# EAGLE design detectino (EAGLE 7.2.0)
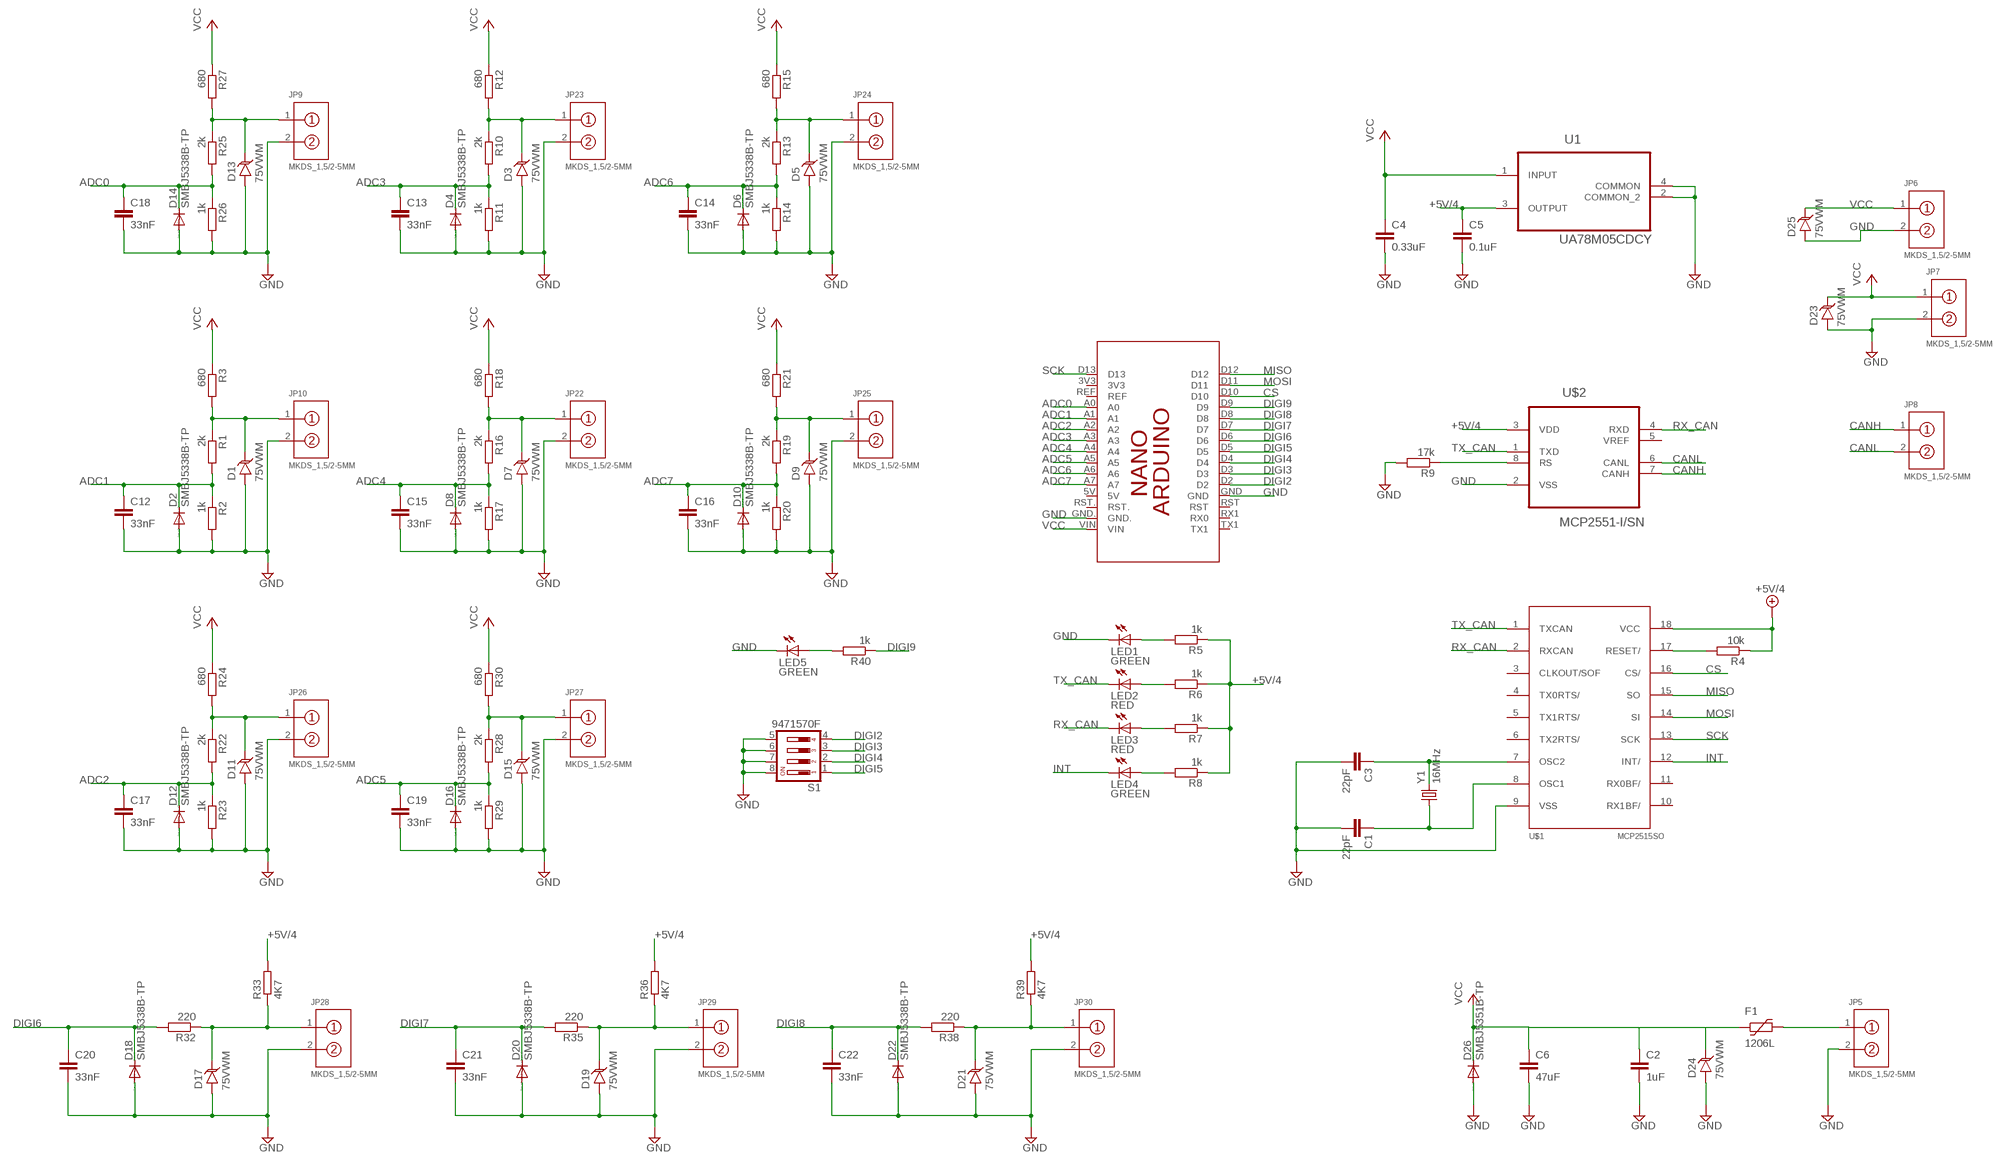
[diagram p0: schematic, sheet 1]

## Parts
C1  22pF  C-EUC1206K  [C1206K]
C2  1uF  C-EUC1206K  [C1206K]
C3  22pF  C-EUC1206K  [C1206K]
C4  0.33uF  C-EUC1206K  [C1206K]
C5  0.1uF  C-EUC1206K  [C1206K]
C6  47uF  C-EUC1206K  [C1206K]
C12  33nF  C-EUC1206K  [C1206K]
C13  33nF  C-EUC1206K  [C1206K]
C14  33nF  C-EUC1206K  [C1206K]
C15  33nF  C-EUC1206K  [C1206K]
C16  33nF  C-EUC1206K  [C1206K]
C17  33nF  C-EUC1206K  [C1206K]
C18  33nF  C-EUC1206K  [C1206K]
C19  33nF  C-EUC1206K  [C1206K]
C20  33nF  C-EUC1206K  [C1206K]
C21  33nF  C-EUC1206K  [C1206K]
C22  33nF  C-EUC1206K  [C1206K]
D1  75VWM  TVS75VWM  [SMC]
D2  SMBJ5338B-TP  DIODE-DO214AA  [DO214AA]
D3  75VWM  TVS75VWM  [SMC]
D4  SMBJ5338B-TP  DIODE-DO214AA  [DO214AA]
D5  75VWM  TVS75VWM  [SMC]
D6  SMBJ5338B-TP  DIODE-DO214AA  [DO214AA]
D7  75VWM  TVS75VWM  [SMC]
D8  SMBJ5338B-TP  DIODE-DO214AA  [DO214AA]
D9  75VWM  TVS75VWM  [SMC]
D10  SMBJ5338B-TP  DIODE-DO214AA  [DO214AA]
D11  75VWM  TVS75VWM  [SMC]
D12  SMBJ5338B-TP  DIODE-DO214AA  [DO214AA]
D13  75VWM  TVS75VWM  [SMC]
D14  SMBJ5338B-TP  DIODE-DO214AA  [DO214AA]
D15  75VWM  TVS75VWM  [SMC]
D16  SMBJ5338B-TP  DIODE-DO214AA  [DO214AA]
D17  75VWM  TVS75VWM  [SMC]
D18  SMBJ5338B-TP  DIODE-DO214AA  [DO214AA]
D19  75VWM  TVS75VWM  [SMC]
D20  SMBJ5338B-TP  DIODE-DO214AA  [DO214AA]
D21  75VWM  TVS75VWM  [SMC]
D22  SMBJ5338B-TP  DIODE-DO214AA  [DO214AA]
D23  75VWM  TVS75VWM  [SMC]
D24  75VWM  TVS75VWM  [SMC]
D25  75VWM  TVS75VWM  [SMC]
D26  SMBJ5351B-TP  DIODE-DO214AA  [DO214AA]
F1  1206L  [1206L]
JP5  MKDS_1,5/2-5MM  [MKDS_1,5/2-5MM]
JP6  MKDS_1,5/2-5MM  [MKDS_1,5/2-5MM]
JP7  MKDS_1,5/2-5MM  [MKDS_1,5/2-5MM]
JP8  MKDS_1,5/2-5MM  [MKDS_1,5/2-5MM]
JP9  MKDS_1,5/2-5MM  [MKDS_1,5/2-5MM]
JP10  MKDS_1,5/2-5MM  [MKDS_1,5/2-5MM]
JP22  MKDS_1,5/2-5MM  [MKDS_1,5/2-5MM]
JP23  MKDS_1,5/2-5MM  [MKDS_1,5/2-5MM]
JP24  MKDS_1,5/2-5MM  [MKDS_1,5/2-5MM]
JP25  MKDS_1,5/2-5MM  [MKDS_1,5/2-5MM]
JP26  MKDS_1,5/2-5MM  [MKDS_1,5/2-5MM]
JP27  MKDS_1,5/2-5MM  [MKDS_1,5/2-5MM]
JP28  MKDS_1,5/2-5MM  [MKDS_1,5/2-5MM]
JP29  MKDS_1,5/2-5MM  [MKDS_1,5/2-5MM]
JP30  MKDS_1,5/2-5MM  [MKDS_1,5/2-5MM]
LED1  GREEN  LEDSML1206  [SML1206]
LED2  RED  LEDSML1206  [SML1206]
LED3  RED  LEDSML1206  [SML1206]
LED4  GREEN  LEDSML1206  [SML1206]
LED5  GREEN  LEDSML1206  [SML1206]
PCB2  ARDUINO_NANO  [ARDUINO_NANO]
R1  2k  R-EU_R1206  [R1206]
R2  1k  R-EU_R1206  [R1206]
R3  680  R-EU_R1206  [R1206]
R4  10k  R-EU_R1206  [R1206]
R5  1k  R-EU_R1206  [R1206]
R6  1k  R-EU_R1206  [R1206]
R7  1k  R-EU_R1206  [R1206]
R8  1k  R-EU_R1206  [R1206]
R9  17k  R-EU_R1206  [R1206]
R10  2k  R-EU_R1206  [R1206]
R11  1k  R-EU_R1206  [R1206]
R12  680  R-EU_R1206  [R1206]
R13  2k  R-EU_R1206  [R1206]
R14  1k  R-EU_R1206  [R1206]
R15  680  R-EU_R1206  [R1206]
R16  2k  R-EU_R1206  [R1206]
R17  1k  R-EU_R1206  [R1206]
R18  680  R-EU_R1206  [R1206]
R19  2k  R-EU_R1206  [R1206]
R20  1k  R-EU_R1206  [R1206]
R21  680  R-EU_R1206  [R1206]
R22  2k  R-EU_R1206  [R1206]
R23  1k  R-EU_R1206  [R1206]
R24  680  R-EU_R1206  [R1206]
R25  2k  R-EU_R1206  [R1206]
R26  1k  R-EU_R1206  [R1206]
R27  680  R-EU_R1206  [R1206]
R28  2k  R-EU_R1206  [R1206]
R29  1k  R-EU_R1206  [R1206]
R30  680  R-EU_R1206  [R1206]
R32  220  R-EU_R1206  [R1206]
R33  4K7  R-EU_R1206  [R1206]
R35  220  R-EU_R1206  [R1206]
R36  4K7  R-EU_R1206  [R1206]
R38  220  R-EU_R1206  [R1206]
R39  4K7  R-EU_R1206  [R1206]
R40  1k  R-EU_R1206  [R1206]
S1  9471570F  DS04  [DS-04]
U1  UA78M05CDCY  [SOT230P700X180-4N]
U$1  MCP2515SO  [SO18L]
U$2  MCP2551-I/SN  [SOIC127P600X175-8N]
Y1  16MHz  CRYSTALHC49US  [HC49US]

## Nets
+5V/4: C5.1 R4.1 R5.1 R6.1 R7.1 R8.1 R33.2 R36.2 R39.2 U1.3(OUTPUT) U$1.18(VCC) U$2.3(VDD)
ADC0: C18.1 D14.C PCB2.A0 R25.2 R26.1
ADC1: C12.1 D2.C PCB2.A1 R1.2 R2.1
ADC2: C17.1 D12.C PCB2.A2 R22.2 R23.1
ADC3: C13.1 D4.C PCB2.A3 R10.2 R11.1
ADC4: C15.1 D8.C PCB2.A4 R16.2 R17.1
ADC5: C19.1 D16.C PCB2.A5 R28.2 R29.1
ADC6: C14.1 D6.C PCB2.A6 R13.2 R14.1
ADC7: C16.1 D10.C PCB2.A7 R19.2 R20.1
CANH [signal20]: JP8.1 U$2.7(CANH)
CANL [signal20]: JP8.2 U$2.6(CANL)
CS [signal]: PCB2.D10 U$1.16(CS/)
DIGI2 [signal]: PCB2.D2 S1.4
DIGI3 [signal]: PCB2.D3 S1.3
DIGI4 [signal]: PCB2.D4 S1.2
DIGI5 [signal]: PCB2.D5 S1.1
DIGI6 [signal]: C20.1 D18.C PCB2.D6 R32.2
DIGI7 [signal]: C21.1 D20.C PCB2.D7 R35.2
DIGI8 [signal]: C22.1 D22.C PCB2.D8 R38.2
DIGI9: PCB2.D9 R40.1
GND [ground]: C1.2 C2.2 C3.2 C4.2 C5.2 C6.2 C12.2 C13.2 C14.2 C15.2 C16.2 C17.2 C18.2 C19.2 C20.2 C21.2 C22.2 D1.A D2.A D3.A D4.A D5.A D6.A D7.A D8.A D9.A D10.A D11.A D12.A D13.A D14.A D15.A D16.A D17.A D18.A D19.A D20.A D21.A D22.A D23.A D24.A D25.A D26.A JP5.2 JP6.2 JP7.2 JP9.2 JP10.2 JP22.2 JP23.2 JP24.2 JP25.2 JP26.2 JP27.2 JP28.2 JP29.2 JP30.2 LED1.C LED5.C PCB2.GND PCB2.GND. R2.2 R9.2 R11.2 R14.2 R17.2 R20.2 R23.2 R26.2 R29.2 S1.5 S1.6 S1.7 S1.8 U1.2(COMMON_2) U1.4(COMMON) U$1.9(VSS) U$2.2(VSS)
INT: LED4.C U$1.12(INT/)
MISO [signal]: PCB2.D12 U$1.15(SO)
MOSI [signal]: PCB2.D11 U$1.14(SI)
N$1 [signal20]: D1.C JP10.1 R1.1 R3.2
N$2 [signal]: R4.2 U$1.17(RESET/)
N$3: C1.1 U$1.8(OSC1) Y1.1
N$4: C3.1 U$1.7(OSC2) Y1.2
N$6: LED1.A R5.2
N$7: LED2.A R6.2
N$8: LED3.A R7.2
N$9: LED4.A R8.2
N$10: R9.1 U$2.8(RS)
N$11 [vcc2]: F1.P$2 JP5.1
N$13 [signal20]: D3.C JP23.1 R10.1 R12.2
N$14 [signal20]: D5.C JP24.1 R13.1 R15.2
N$15 [signal20]: D7.C JP22.1 R16.1 R18.2
N$16 [signal20]: D9.C JP25.1 R19.1 R21.2
N$17 [signal20]: D11.C JP26.1 R22.1 R24.2
N$18 [signal20]: D13.C JP9.1 R25.1 R27.2
N$19 [signal20]: D15.C JP27.1 R28.1 R30.2
N$21 [signal20]: D17.C JP28.1 R32.1 R33.1
N$23 [signal20]: D19.C JP29.1 R35.1 R36.1
N$25 [signal20]: D21.C JP30.1 R38.1 R39.1
N$26: LED5.A R40.2
RX_CAN [signal]: LED3.C U$1.2(RXCAN) U$2.4(RXD)
SCK [signal]: PCB2.D13 U$1.13(SCK)
TX_CAN [signal]: LED2.C U$1.1(TXCAN) U$2.1(TXD)
VCC [vcc]: C2.1 C4.1 C6.1 D23.C D24.C D25.C D26.C F1.P$1 JP6.1 JP7.1 PCB2.VIN R3.1 R12.1 R15.1 R18.1 R21.1 R24.1 R27.1 R30.1 U1.1(INPUT)
Unconnected: PCB2.3V3 PCB2.5V PCB2.REF PCB2.RST PCB2.RST. PCB2.RX1(RX0) PCB2.TX1 U$1.3(CLKOUT/SOF) U$1.4(TX0RTS/) U$1.5(TX1RTS/) U$1.6(TX2RTS/) U$1.10(RX1BF/) U$1.11(RX0BF/) U$2.5(VREF)

## Library data of the parts
C1-C6 C12-C22 = rcl:C-EU: CAPACITOR, European symbol
D1 D3 D5 D7 D9 D11 D13 D15 D17 D19 D21 D23-D25 = SparkFun-DiscreteSemi:TVS: Transient voltage suppressor- prevents ESD on inputs.; PROD_ID: DIO-12443
D2 D4 D6 D8 D10 D12 D14 D16 D18 D20 D22 D26 = diode:DIODE-: DIODE
F1 = ptc-littlefuse:1206L
JP5-JP10 JP22-JP30 = con-phonenix-mkds:MKDS_1,5/2-5MM
LED1-LED5 = led:LED: LED OSRAM: - CHIPLED LG R971, LG N971, LY N971, LG Q971, LY Q971, LO R971, LY R971 LH N974, LH R974 LS Q976, LO Q976, LY Q976 LO Q996 - Hyper CHIPLED LW Q18S LB Q993, LB Q99A, LB R99A - SideLED LS A670, LO A670, LY A670, LG A670, LP A670 LB A673, LV A673, LT A673, LW A673 LH A674 LY A675 LS A676, LA A676, LO A676, LY A676, LW A676 LS A679, LY A679, LG A679 - Hyper Micro SIDELED® LS Y876, LA Y876, LO Y876, LY Y876 LT Y87S - SmartLED LW L88C, LW L88S LB L89C, LB L89S, LG L890 LS L89K, LO L89K, LY L89K LS L896, LA L896, LO L896, LY L896 - TOPLED LS T670, LO T670, LY T670, LG T670, LP T670 LSG T670, LSP T670, LSY T670, LOP T670, LYG T670 LG T671, LOG T671, LSG T671 LB T673, LV T673, LT T673, LW T673 LH T674 LS T676, LA T676, LO T676, LY T676, LB T676, LH T676, LSB T676, LW T676 LB T67C, LV T67C, LT T67C, LS T67K, LO T67K, LY T67K, LW E67C LS E67B, LA E67B, LO E67B, LY E67B, LB E67C, LV E67C, LT E67C LW T67C LS T679, LY T679, LG T679 LS T770, LO T770, LY T770, LG T770, LP T770 LB T773, LV T773, LT T773, LW T773 LH T774 LS E675, LA E675, LY E675, LS T675 LS T776, LA T776, LO T776, LY T776, LB T776 LHGB T686 LT T68C, LB T68C - Hyper Mini TOPLED® LB M676 - Mini TOPLED Santana® LG M470 LS M47K, LO M47K, LY M47K Source: http://www.osram.convergy.de LUXEON: - LUMILED® LXK2-PW12-R00, LXK2-PW12-S00, LXK2-PW14-U00, LXK2-PW14-V00 LXK2-PM12-R00, LXK2-PM12-S00, LXK2-PM14-U00 LXK2-PE12-Q00, LXK2-PE12-R00, LXK2-PE12-S00, LXK2-PE14-T00, LXK2-PE14-U00 LXK2-PB12-K00, LXK2-PB12-L00, LXK2-PB12-M00, LXK2-PB14-N00, LXK2-PB14-P00, LXK2-PB14-Q00 LXK2-PR12-L00, LXK2-PR12-M00, LXK2-PR14-Q00, LXK2-PR14-R00 LXK2-PD12-Q00, LXK2-PD12-R00, LXK2-PD12-S00 LXK2-PH12-R00, LXK2-PH12-S00 LXK2-PL12-P00, LXK2-PL12-Q00, LXK2-PL12-R00 Source: www.luxeon.com KINGBRIGHT: KA-3528ASYC Source: www.kingbright.com
PCB2 = E14_Arduino_published:ARDUINO_NANO: Device for representing an Arduino Nano board with a footprint in an EAGLE design. Created by Dave Young for Element14. More EAGLE documentation at: http://www.element14.com/community/community/knode/cadsoft_eagle
R1-R30 R32 R33 R35 R36 R38-R40 = rcl:R-EU_: RESISTOR, European symbol
S1 = switch-dil:DS04: DIL/CODE SWITCH; OC_FARNELL: 9471570; OC_NEWARK: unknown
U1 = Texas Instruments_By_element14_Batch_1:UA78M05CDCY: IC, LINEAR VOLT REGULATOR, 5V; MPN: UA78M05CDCY; OC_FARNELL: 1575761; OC_NEWARK: 77C1885; PACKAGE: SOT-223-3; SUPPLIER: TEXAS INSTRUMENTS
U$1 = MCP2515_MT:MCP2515*: MCP2515 Standalone CAN-Controller by Microchip Eagle-Lib. by MartinThomas
U$2 = Microchip_By_element14_Batch_1:MCP2551-I/SN: High-Speed CAN Transceiver; MPN: MCP2551-I/SN; OC_FARNELL: 9758569; OC_NEWARK: 69K7604; PACKAGE: SOIC-8; SUPPLIER: Microchip
Y1 = SparkFun-FreqCtrl:CRYSTAL: Various standard crystals. Proven footprints.

## Net classes
0 default: width 0.254 mm, clearance 0.203 mm
1 ground: width 0.508 mm, clearance 0.203 mm
2 vcc: width 0.508 mm, clearance 0.203 mm
3 signal: width 0.254 mm, clearance 0.203 mm
4 vcc2: width 0.762 mm, clearance 0.203 mm
5 signal20: width 0.508 mm, clearance 0.203 mm

## Board
JP13: 710-691211720002 Mouser
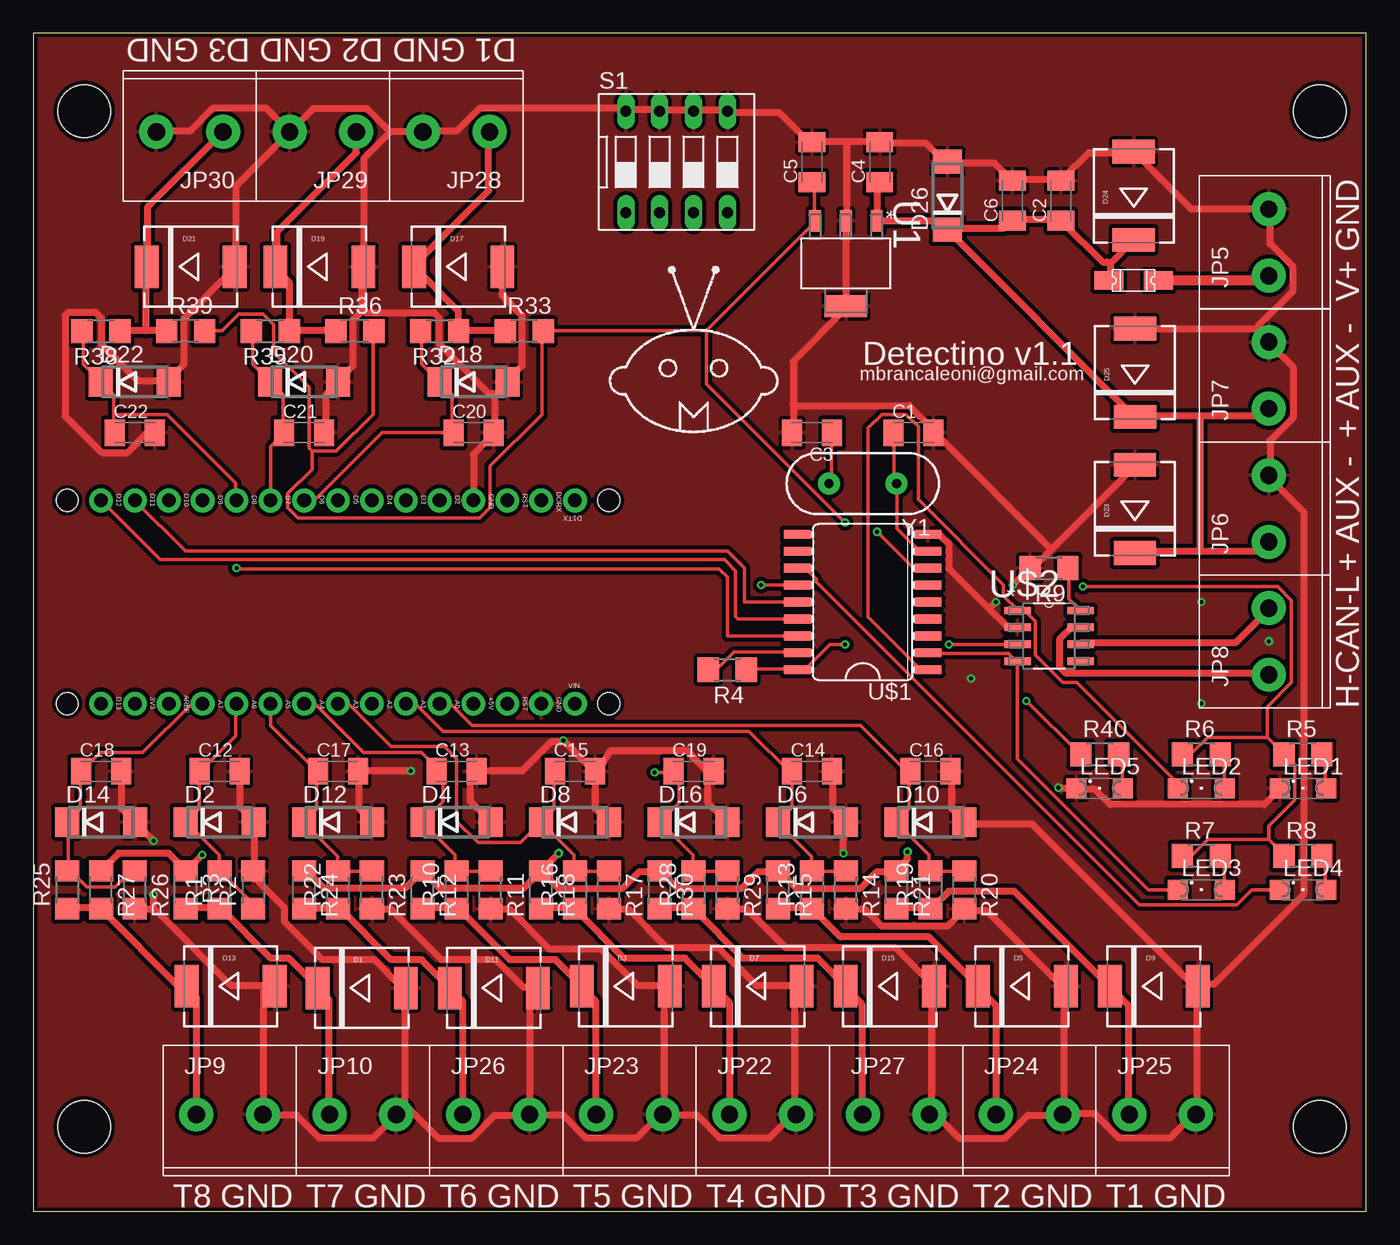
[diagram p1: board, top side]
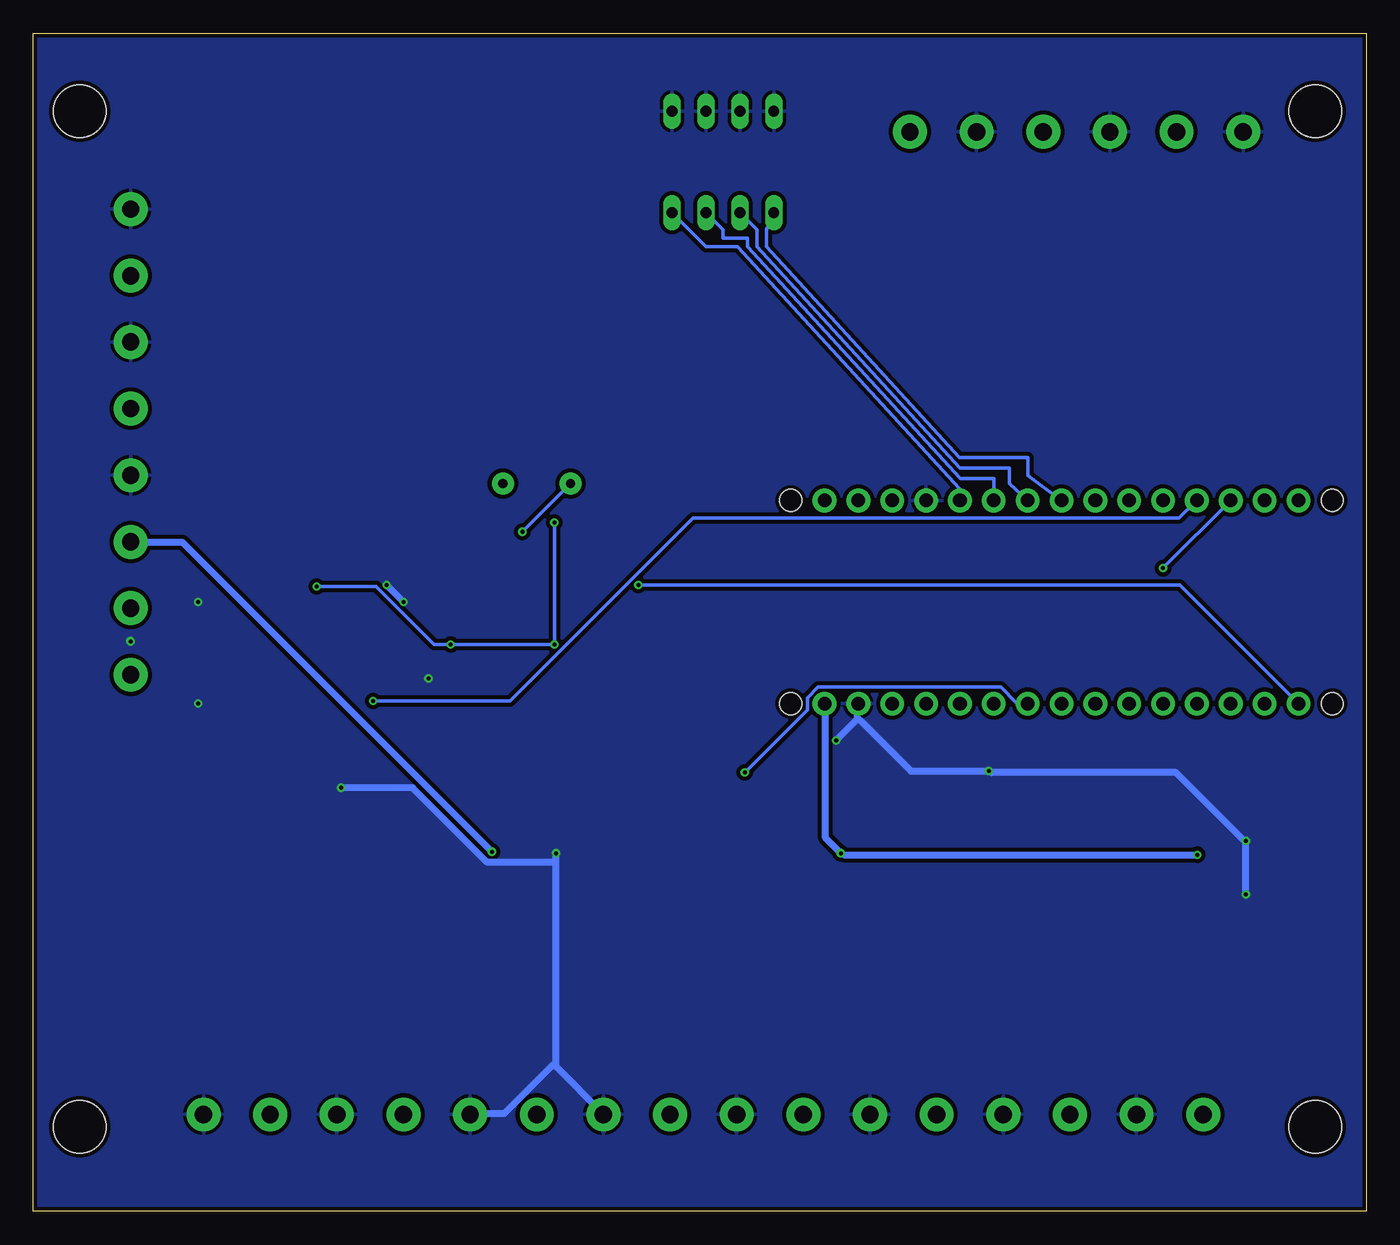
[diagram p2: board, bottom side, seen from below]

Size 100 x 88.39 mm. Coordinates in mm from the lower left corner, seen from the top.
Outline: 0,0 100,0 100,88.39 0,88.39 0,0
Copper layers (1*16): Top 0.035mm / dielectric 1.5mm / Bottom 0.035mm
Design rules "SeeedStudio_2layer_DRU_no_angle_20140221": minimum track width 6mil, minimum drill 12mil, track to track 6mil, track to pad 6mil, pad to pad 6mil, via to via 6mil, smd to smd 0mil, copper to edge 10mil, drill to drill 10mil, minimum pad ring 10mil, minimum via ring 6mil, stop-mask expansion 2mil, vias tented up to drill 100mil, thermal gap 10mil
Holes 3.96 mm at 96.52,6.35 96.52,82.55 3.81,82.55 3.81,6.35

### Footprints (pad centres in the part's own frame; a part is rotated, then mirrored left to right if it is on the bottom)
C1206K = smd 1.5 x 2: 1 -1.5,0; 2 1.5,0
SMC = smd 1.778 x 3.175: A 3.302,0; C -3.302,0
DO214AA = smd 1.8 x 2.2: A 2.55,0; C -2.55,0
1206L = smd 2.16 x 1.4: P$1 -1.85,0; P$2 1.85,0
MKDS_1,5/2-5MM = drill 1.3 pad 2.54: 1 -2.5,0; 2 2.5,0
SML1206 = smd 1.5 x 1.5: A 1.75,0; C -1.75,0
ARDUINO_NANO = drill 1.016 pad 1.778: 3V3 6.35,1.27; 5V 31.75,1.27; A0 11.43,1.27; A1 13.97,1.27; A2 16.51,1.27; A3 19.05,1.27; A4 21.59,1.27; A5 24.13,1.27; A6 26.67,1.27; A7 29.21,1.27; D2 29.21,16.51; D3 26.67,16.51; D4 24.13,16.51; D5 21.59,16.51; D6 19.05,16.51; D7 16.51,16.51; D8 13.97,16.51; D9 11.43,16.51; D10 8.89,16.51; D11 6.35,16.51; D12 3.81,16.51; D13 3.81,1.27; GND 31.75,16.51; GND. 36.83,1.27; REF 8.89,1.27; RST 34.29,16.51; RST. 34.29,1.27; RX1 36.83,16.51; TX1 39.37,16.51; VIN 39.37,1.27 | hole 1.651: 1.27,1.27; 1.27,16.51; 41.91,16.51; 41.91,1.27
R1206 = smd 1.6 x 1.803: 1 -1.422,0; 2 1.422,0
DS-04 = drill 0.813 long: 1 -3.81,-3.81; 2 -1.27,-3.81; 3 1.27,-3.81; 4 3.81,-3.81; 5 3.81,3.81; 6 1.27,3.81; 7 -1.27,3.81; 8 -3.81,3.81
SOT230P700X180-4N = smd 1.626 x 0.889: 1 -3.2,2.311; 2 -3.2,0; 3 -3.2,-2.311 | smd 1.626 x 3.175: 4 3.2,0
SO18L = smd 0.66 x 2.032: 1 -5.08,-4.902; 2 -3.81,-4.902; 3 -2.54,-4.902; 4 -1.27,-4.902; 5 0,-4.902; 6 1.27,-4.902; 7 2.54,-4.902; 8 3.81,-4.902; 9 5.08,-4.902; 10 5.08,4.902; 11 3.81,4.902; 12 2.54,4.902; 13 1.27,4.902; 14 0,4.902; 15 -1.27,4.902; 16 -2.54,4.902; 17 -3.81,4.902; 18 -5.08,4.902
SOIC127P600X175-8N = smd 1.981 x 0.559: 1 -2.362,1.905; 2 -2.362,0.635; 3 -2.362,-0.635; 4 -2.362,-1.905; 5 2.362,-1.905; 6 2.362,-0.635; 7 2.362,0.635; 8 2.362,1.905
HC49US = drill 0.7 pad 1.651: 1 -2.54,0; 2 2.54,0

### Placement (x,y rotation side)
C1  66.04,58.42 0 top
C2  77.09,75.82 90 top
C3  58.42,58.42 180 top
C4  63.5,78.74 90 top
C5  58.42,78.74 90 top
C6  73.46,75.82 90 top
C12  13.97,33.02 0 top
C13  31.75,33.02 0 top
C14  58.42,33.02 0 top
C15  40.64,33.02 0 top
C16  67.31,33.02 0 top
C17  22.86,33.02 0 top
C18  5.08,33.02 0 top
C19  49.53,33.02 0 top
C20  33.02,58.42 0 top
C21  20.32,58.42 0 top
C22  7.62,58.42 0 top
D1  24.64,16.76 0 top
D2  13.97,29.21 0 top
D3  44.45,16.89 0 top
D4  31.75,29.21 0 top
D5  74.17,16.89 0 top
D6  58.42,29.21 0 top
D7  54.36,16.89 0 top
D8  40.64,29.21 0 top
D9  84.07,16.89 0 top
D10  67.31,29.21 0 top
D11  34.54,16.76 0 top
D12  22.86,29.21 0 top
D13  14.81,16.89 0 top
D14  5.08,29.21 0 top
D15  64.26,16.89 0 top
D16  49.53,29.21 0 top
D17  31.88,70.87 0 top
D18  33.02,62.23 0 top
D19  21.46,70.87 0 top
D20  20.32,62.23 0 top
D21  11.81,70.87 0 top
D22  7.62,62.23 0 top
D23  82.65,52.71 90 top
D24  82.55,76.2 90 top
D25  82.65,62.93 90 top
D26  68.58,76.2 90 top
F1  82.55,69.85 0 top
JP5  92.69,72.7 90 top
JP6  92.69,52.73 90 top
JP7  92.69,62.73 90 top
JP8  92.69,42.76 90 top
JP9  14.73,7.27 0 top
JP10  24.73,7.27 0 top
JP22  54.73,7.27 0 top
JP23  44.73,7.27 0 top
JP24  74.73,7.27 0 top
JP25  84.73,7.27 0 top
JP26  34.73,7.27 0 top
JP27  64.73,7.27 0 top
JP28  31.73,81 180 top
JP29  21.73,81 180 top
JP30  11.73,81 180 top
LED1  95.25,31.75 0 top
LED2  87.63,31.75 0 top
LED3  87.63,24.13 0 top
LED4  95.25,24.13 0 top
LED5  80.01,31.75 0 top
PCB2  1.27,36.83 0 top
R1  13.97,24.13 90 top
R2  16.51,24.13 90 top
R3  11.43,24.13 270 top
R4  52.07,40.64 180 top
R5  95.25,34.29 0 top
R6  87.63,34.29 0 top
R7  87.63,26.67 0 top
R8  95.25,26.67 0 top
R9  76.2,48.26 180 top
R10  31.75,24.13 90 top
R11  34.29,24.13 270 top
R12  29.21,24.13 270 top
R13  58.42,24.13 90 top
R14  60.96,24.13 270 top
R15  55.88,24.13 270 top
R16  40.64,24.13 90 top
R17  43.18,24.13 270 top
R18  38.1,24.13 270 top
R19  67.31,24.13 90 top
R20  69.85,24.13 270 top
R21  64.77,24.13 270 top
R22  22.86,24.13 90 top
R23  25.4,24.13 270 top
R24  20.32,24.13 270 top
R25  2.54,24.13 90 top
R26  7.62,24.13 270 top
R27  5.08,24.13 270 top
R28  49.53,24.13 90 top
R29  52.07,24.13 270 top
R30  46.99,24.13 270 top
R32  30.48,66.04 180 top
R33  36.83,66.04 0 top
R35  17.78,66.04 180 top
R36  24.13,66.04 0 top
R38  5.08,66.04 180 top
R39  11.43,66.04 0 top
R40  80.01,34.29 0 top
S1  48.26,78.74 0 top
U1  60.96,71.12 270 top
U$1  62.23,45.72 90 top
U$2  76.2,43.18 0 top
U$5  [LOGO]  49.53,62.23 0 top
Y1  62.23,54.61 180 top

### Tracks (layer width: path | path; a pad name or v marks a point on that pad's centre or on a via)
+5V/4  (via drill 0.3)
  Top 0.254: 92.69,27.9 88.11,27.9 86.97,26.76 86.28,26.76 R7.1 | 92.69,27.9 93.83,26.76 R8.1 | 92.57,35.56 88.11,35.56 86.86,34.3 86.28,34.3 R6.1 | 92.57,35.56 93.83,34.3 R5.1 93.94,34.19 94.63,33.5 94.63,30.87 92.69,28.93 92.69,27.9 | R4.1 53.59,40.7 57.25,40.7 U$1.18 57.37,40.7 57.94,40.7 59.77,42.53 v60.91,42.53 | v68.68,42.53 73.83,42.53 U$2.3 | 92.57,35.56 92.57,37.85 94.4,39.68 94.4,45.85 93.37,46.88 v78.74,46.88 | 20.9,57.05 20.68,57.28 20.68,61.85 18.05,64.48 18.05,66.53 17.25,67.33 15.42,67.33 14.16,66.08 12.9,66.08 R39.2 | 20.9,57.05 22.73,57.05 25.48,59.79 25.48,65.96 R36.2 | C5.1 58.51,77.16 58.62,77.05 58.62,74.42 U1.3 58.62,74.19 50.51,66.08 | 50.51,66.08 38.28,66.08 R33.2 38.16,65.96 38.16,59.79 34.28,55.91 34.28,52.82 33.48,52.02 19.88,52.02 19.07,52.82 19.07,53.85 20.9,55.68 20.9,57.05 | v60.91,51.68 50.51,62.08 50.51,66.08
  Bottom 0.254: v78.74,46.88 74.28,46.88 69.94,42.53 v68.68,42.53 v60.91,42.53 v60.91,51.68
ADC0
  Top 0.254: R26.1 7.53,25.5 7.3,25.5 6.16,24.36 3.99,24.36 2.73,25.62 R25.2 2.62,25.62 2.62,29.16 D14.C 2.62,29.27 3.53,30.19 3.53,32.93 C18.1 3.65,33.05 5.02,34.42 8.22,34.42 11.88,38.08 12.68,38.08 PCB2.A0
ADC1
  Top 0.254: R2.1 16.45,22.76 16.45,23.1 14.05,25.5 R1.2 13.93,25.62 13.93,26.76 11.53,29.16 D2.C 11.53,29.27 12.45,30.19 12.45,32.93 C12.1 12.56,33.05 15.19,35.67 15.19,38.08 PCB2.A1
ADC2
  Top 0.254: R23.1 25.36,25.5 22.96,25.5 R22.2 22.85,25.62 22.85,26.64 20.33,29.16 D12.C 20.33,29.27 21.25,30.19 21.25,32.93 C17.1 21.25,33.05 17.82,36.47 17.82,38.08 PCB2.A2
ADC3
  Top 0.254: R11.1 34.28,25.5 31.76,25.5 R10.2 31.65,25.62 31.65,26.76 29.25,29.16 D4.C 29.25,29.27 30.73,30.76 30.73,32.93 C13.1 30.62,32.93 29.13,34.42 24.79,34.42 21.13,38.08 20.33,38.08 PCB2.A3
ADC4
  Top 0.254: R17.1 43.08,25.5 40.68,25.5 R16.2 40.56,25.62 40.56,26.76 38.16,29.16 D8.C | C15.1 39.08,32.93 39.08,30.19 38.16,29.27 D8.C | PCB2.A4 22.96,38.08 23.65,38.08 26.85,34.87 30.85,34.87 31.76,33.96 31.76,29.27 33.36,27.67 36.56,27.67 38.05,29.16 D8.C
ADC5  (via drill 0.3)
  Top 0.254: R29.1 51.99,25.5 49.59,25.5 R28.2 49.48,25.62 49.48,26.76 47.08,29.16 D16.C 47.08,29.27 48.45,30.64 48.45,32.93 C19.1 48.34,32.93 v46.62,32.93
  Bottom 0.254: v46.62,32.93 41.93,37.62 41.93,38.53 41.13,39.33 27.42,39.33 26.28,38.19 25.48,38.19 PCB2.A5
ADC6
  Top 0.254: R14.1 60.91,25.5 58.51,25.5 R13.2 58.39,25.62 58.39,26.64 55.88,29.16 D6.C 55.88,29.27 56.91,30.3 56.91,32.93 C14.1 56.79,32.93 53.71,36.02 30.73,36.02 28.68,38.08 27.99,38.08 PCB2.A6
ADC7
  Top 0.254: R20.1 69.83,25.5 67.31,25.5 R19.2 67.2,25.62 67.2,26.76 64.8,29.16 D10.C 64.8,29.27 65.71,30.19 65.71,32.93 C16.1 65.59,32.93 62.05,36.47 32.91,36.47 31.31,38.08 30.5,38.08 PCB2.A7
CANH
  Top 0.508: U$2.7 78.51,43.79 77.83,43.79 77.03,42.99 77.03,40.82 77.48,40.36 92.69,40.36 JP8.1
CANL
  Top 0.508: U$2.6 78.63,42.65 90.17,42.65 92.69,45.16 JP8.2
CS  (via drill 0.3)
  Top 0.254: U$1.16 52.07,43.18 52.07,47.6 51.46,48.21 15.29,48.21 v15.24,48.26
  Bottom 0.254: v15.24,48.26 PCB2.D10
DIGI2
  Bottom 0.254: PCB2.D2 30.48,54.18 47.17,72.39 49.53,72.39 S1.4
DIGI3
  Bottom 0.254: S1.3 48.26,73.66 48.26,73.02 46.41,73.02 46.41,72.39 30.46,54.97 27.94,54.97 PCB2.D3
DIGI4
  Bottom 0.254: S1.2 45.72,73.66 45.72,72.39 30.48,55.75 26.77,55.75 26.77,54.61 PCB2.D4
DIGI5
  Bottom 0.254: S1.1 45.01,73.66 45.01,72.39 30.5,56.57 25.4,56.57 25.4,55.19 PCB2.D5
DIGI6
  Top 0.254: R32.2 29.13,65.96 29.13,63.56 30.39,62.31 D18.C 30.5,62.19 31.42,61.28 31.42,58.42 C20.1 26.16,58.42 21.13,53.39 20.33,53.39 PCB2.D6
DIGI7
  Top 0.254: R35.2 16.45,65.96 16.45,63.56 17.7,62.31 D20.C 17.82,62.19 18.73,61.28 18.73,58.42 C21.1 18.73,58.31 17.82,57.39 17.82,53.39 PCB2.D7
DIGI8
  Top 0.254: R38.2 3.76,65.96 3.76,63.56 5.02,62.31 D22.C 5.13,62.19 6.04,61.28 6.04,59.79 | 6.04,59.79 6.04,58.42 C22.1 | 6.04,59.79 10.05,59.79 15.19,54.65 15.19,53.39 PCB2.D8
DIGI9  (via drill 0.3)
  Top 0.254: v74.51,38.3 78.51,34.3 R40.1
  Bottom 0.254: v74.51,38.3 64.22,38.3 50.51,52.02 14.05,52.02 12.79,53.28 PCB2.D9
GND  (via drill 0.3)
  Top 0.508: D12.A 25.36,29.27 24.45,30.19 24.45,32.93 C17.2 24.68,33.05 v28.32,33.05 | D16.A 51.99,29.27 50.62,30.64 50.62,32.93 C19.2 50.39,33.16 49.03,34.58 43.32,34.58 42.39,33.05 C15.2 | D4.A 34.28,29.27 32.79,30.76 32.79,32.93 C13.2 33.02,33.05 36.68,33.05 38.85,35.22 39.53,35.22 v39.76,35.33 41.93,33.16 C15.2 | C15.2 42.16,32.93 42.16,30.19 43.08,29.27 D8.A | C18.2 6.62,32.93 6.62,30.19 7.53,29.27 D14.A 7.76,29.04 v9.02,27.79 | 9.02,22.64 9.13,22.64 14.85,16.93 18.05,16.93 D13.A 17.25,16.7 17.25,7.33 JP9.2 17.48,7.21 19.76,7.21 21.48,5.5 25.48,5.5 27.08,7.1 JP10.2 | 9.02,22.64 7.64,22.64 R26.2 | 9.02,22.64 v9.02,23.79 | R14.2 61.02,22.64 62.39,22.64 63.65,21.39 68.57,21.39 69.83,22.64 R20.2 70.05,22.53 71.54,22.53 77.14,16.93 D5.A 77.37,16.82 77.37,7.44 77.25,7.33 JP24.2 | C16.2 68.91,32.93 68.91,30.19 69.83,29.27 D10.A 70.05,29.04 74.97,29.04 87.08,16.93 D9.A | D9.A 87.31,16.82 87.31,7.33 JP25.2 86.97,7.21 85.26,5.5 81.48,5.5 79.65,7.33 77.6,7.33 JP24.2 | R23.2 25.48,22.64 26.85,22.64 30.62,18.87 34.73,18.87 36.79,16.82 37.82,16.82 D11.A 37.25,16.59 37.25,7.33 JP26.2 | C12.2 15.53,32.93 15.53,30.3 16.45,29.39 D2.A 16.56,29.16 16.56,25.62 R2.2 16.68,25.39 16.68,24.93 18.85,22.76 18.85,21.73 21.7,18.87 25.59,18.87 27.65,16.82 D1.A 27.88,16.7 27.88,7.9 27.3,7.33 JP10.2 | JP26.2 37.02,7.21 34.62,7.21 32.91,5.5 30.39,5.5 28.11,7.79 JP10.2 | R11.2 34.39,22.64 35.76,22.64 38.73,19.67 42.62,19.67 45.36,16.93 47.65,16.93 D3.A 47.31,16.7 47.31,7.33 JP23.2 | R29.2 52.11,22.64 53.59,22.64 56.45,19.79 64.68,19.79 67.54,16.93 D15.A 67.42,16.7 67.42,7.44 67.31,7.33 JP27.2 67.65,7.33 69.48,5.5 72.91,5.5 74.62,7.21 77.03,7.21 JP24.2
  Top 0.508: R17.2 43.19,22.64 44.68,22.64 47.54,19.79 51.42,19.79 54.28,16.93 57.59,16.93 D7.A 57.14,16.7 57.14,7.33 JP22.2 56.91,7.21 55.19,5.5 51.54,5.5 49.82,7.21 47.54,7.21 JP23.2 | LED1.C 93.48,31.67 92.34,30.53 80.8,30.53 79.65,31.67 78.28,31.67 LED5.C 78.05,31.79 v76.91,31.79 | C14.2 59.99,32.93 59.99,30.19 60.91,29.27 D6.A 60.79,29.04 v60.79,26.87 | JP26.2 37.48,7.21 39.76,7.21 41.48,5.5 45.25,5.5 46.96,7.21 JP23.2 | C22.2 8.56,58.42 7.07,56.93 5.13,56.93 2.39,59.68 2.39,67.22 2.62,67.45 4.67,67.45 5.13,66.99 5.13,65.05 7.87,62.31 10.16,62.31 D22.A 10.27,62.54 11.3,63.56 11.3,66.99 15.07,70.76 D21.A 15.19,71.11 15.19,76.94 19.07,80.82 JP29.2 | 34.62,61.28 34.62,58.42 C20.2 34.39,58.19 33.02,56.82 PCB2.GND | 34.62,61.28 35.53,62.19 D18.A 35.65,62.42 36.68,63.45 36.68,67.22 35.19,68.71 35.19,70.76 D17.A | C21.2 21.93,58.42 21.93,61.28 22.85,62.19 D20.A 22.96,62.42 23.99,63.45 23.99,66.88 24.68,67.56 | 24.68,67.56 24.68,70.76 D19.A 24.79,71.11 24.79,78.99 26.62,80.82 26.73,81.05 | JP30.2 9.25,81.05 11.76,81.05 13.47,82.77 17.48,82.77 19.19,81.05 JP29.2 | 26.73,81.05 29.13,81.05 JP28.2 29.48,81.05 31.76,81.05 33.48,82.77 44.22,82.77 S1.8 44.45,82.65 46.96,82.65 S1.7 47.19,82.65 49.48,82.65 S1.6 49.71,82.65 51.99,82.65 S1.5 52.22,82.42 55.99,82.42 58.17,80.25 C5.2 58.51,80.25 61.02,80.25 | 26.73,81.05 25.02,82.77 21.02,82.77 19.42,81.17 JP29.2 | 34.62,61.28 34.39,61.39 34.16,61.39 30.39,65.16 30.39,67.11 30.05,67.45 24.91,67.45 24.68,67.56 | 91.77,66.19 82.74,66.19 D25.A | 91.77,66.19 92.69,65.28 JP7.2 92.8,65.05 94.51,63.34 94.51,59.56 92.8,57.85 92.8,55.33 JP6.2 92.8,54.99 95.31,52.48 95.31,23.79 88.57,17.04 87.54,17.04 D9.A
  Top 0.508: 91.77,66.19 91.88,66.42 94.51,69.05 94.51,70.88 92.8,72.59 92.8,75.11 JP5.2 92.46,75.22 86.86,75.22 82.74,79.34 D24.A 82.51,79.45 79.2,79.45 77.25,77.51 C2.2 77.03,77.39 73.48,77.39 C6.2 73.25,77.51 72.11,78.65 68.68,78.65 D26.A 68.34,78.77 66.97,80.14 63.65,80.14 C4.2 63.42,80.25 61.02,80.25 | 71.71,45.22 68.68,48.25 68.68,50.08 68,50.76 67.2,50.76 U$1.9 | 71.71,45.22 73.03,43.9 73.83,43.9 U$2.2 | 76.4,49.68 82.63,55.91 D23.A | 76.4,49.68 75.08,48.36 74.85,48.36 R9.2 74.62,48.13 v73.48,46.99 | v72.23,45.73 71.71,45.22 | 57.02,60.48 57.02,63.79 60.91,67.68 U1.4 61.02,68.02 61.02,74.31 U1.2 61.02,74.54 61.02,80.25 | 57.02,60.48 57.02,58.42 C3.2 | 57.02,60.48 65.71,60.48 67.54,58.65 C1.2 67.77,58.31 76.4,49.68
  Bottom 0.508: 38.16,36.93 38.16,38.08 PCB2.GND. | v39.76,35.33 38.16,36.93 | 38.16,36.93 37.93,36.82 34.16,33.05 v28.32,33.05 28.09,32.93 14.28,32.93 9.25,27.9 v9.02,27.79 v9.02,23.79 | 60.79,10.99 60.79,10.87 57.25,7.33 JP22.2 | 60.79,10.99 60.79,26.19 | 60.79,26.19 v60.79,26.87 | JP27.2 67.2,7.33 64.68,7.33 61.02,10.99 60.79,10.99 | v76.91,31.79 71.54,31.79 65.94,26.19 60.79,26.19 | v73.48,46.99 v72.23,45.73
  other vias: 70.36,39.98 87.63,45.72 87.63,38.1 92.71,42.77
  pour Bottom (isolate 0.305): 0,88.9 100.33,88.9 100.33,0 0,0
  pour Top (isolate 0.305): 0,88.9 100.33,88.9 100.33,0 0,0
INT
  Top 0.254: LED4.C 91.43,24.13 90.28,22.99 82.97,22.99 58.74,47.22 58.74,47.45 57.94,48.25 57.37,48.25 U$1.12
MISO
  Top 0.254: U$1.15 52.86,44.45 52.68,44.63 52.68,48.06 51.84,48.9 9.53,48.9 PCB2.D12
MOSI
  Top 0.254: U$1.14 53.34,45.72 53.34,48.26 52.07,49.53 11.43,49.53 PCB2.D11
N$1
  Top 0.508: R3.2 11.53,22.76 13.93,22.76 R1.1 14.16,22.64 17.82,18.99 19.19,18.99 21.36,16.82 D1.C 21.48,16.59 22.16,15.9 22.16,7.33 JP10.1
N$2
  Top 0.254: R4.2 50.74,40.7 51.31,40.7 52.56,41.96 57.25,41.96 U$1.17
N$3
  Top 0.254: C1.1 64.57,58.42 64.57,54.76 64.68,54.65 Y1.1 64.8,54.53 64.8,51.22 66.4,49.62 67.08,49.62 U$1.8
N$4  (via drill 0.3)
  Top 0.254: C3.1 59.88,58.42 59.88,54.76 59.77,54.65 Y1.2 | v63.31,50.99 65.94,48.36 67.08,48.36 U$1.7
  Bottom 0.254: Y1.2 v63.31,50.99
N$6
  Top 0.254: LED1.A 96.91,31.79 96.91,33.96 96.69,34.19 R5.2
N$7
  Top 0.254: LED2.A 89.37,31.79 89.37,33.96 89.14,34.19 R6.2
N$8
  Top 0.254: LED3.A 89.37,26.42 89.14,26.64 R7.2
N$9
  Top 0.254: LED4.A 96.91,24.13 96.91,26.42 96.69,26.64 R8.2
N$10
  Top 0.254: R9.1 77.71,48.25 77.71,45.96 78.51,45.16 U$2.8
N$11
  Top 0.762: F1.P$2 92.34,69.85 JP5.1
N$13
  Top 0.508: R12.2 29.25,22.76 31.65,22.76 R10.1 31.99,22.64 35.76,18.87 39.19,18.87 41.13,16.93 D3.C 41.25,16.7 42.16,15.79 42.16,7.33 JP23.1
N$14
  Top 0.508: R15.2 55.88,22.76 58.39,22.76 R13.1 58.62,22.53 60.57,20.59 67.2,20.59 70.85,16.93 D5.C 70.97,16.7 72.23,15.44 72.23,7.33 JP24.1
N$15
  Top 0.508: R18.2 38.16,22.76 40.56,22.76 R16.1 40.79,22.53 44.34,18.99 48.91,18.99 50.96,16.93 D7.C 51.19,16.7 52.22,15.67 52.22,7.33 JP22.1
N$16
  Top 0.508: R21.2 64.8,22.76 67.31,22.76 R19.1 67.54,22.87 68.68,24.02 73.6,24.02 80.68,16.93 D9.C 80.91,16.7 82.17,15.44 82.17,7.33 JP25.1
N$17
  Top 0.508: R24.2 20.33,22.76 22.85,22.76 R22.1 23.08,22.64 26.85,18.87 29.13,18.87 D11.C 32.22,15.79 32.22,7.33 JP26.1
N$18
  Top 0.508: R25.1 2.62,22.76 5.02,22.76 R27.2 5.24,22.53 10.85,16.93 11.42,16.93 D13.C 11.65,16.7 12.22,16.13 12.22,7.33 JP9.1
N$19
  Top 0.508: R30.2 47.08,22.76 49.48,22.76 R28.1 49.71,22.53 53.25,18.99 58.85,18.99 60.91,16.93 D15.C 61.02,16.7 62.17,15.56 62.17,7.33 JP27.1
N$21
  Top 0.508: R33.1 35.31,66.08 31.99,66.08 R32.1 31.88,66.31 31.88,67.56 D17.C 28.68,71.11 34.16,76.59 34.16,80.94 JP28.1
N$23
  Top 0.508: R36.1 22.62,66.08 19.3,66.08 R35.1 19.19,66.31 19.19,69.74 18.16,70.76 D19.C 18.28,71.11 18.28,73.51 24.22,79.45 24.22,80.94 JP29.1
N$25
  Top 0.508: 8.45,66.08 9.93,66.08 R39.1 | 8.45,66.08 6.5,66.08 R38.1 | 8.45,66.08 8.45,70.76 D21.C 8.56,71.11 8.56,75.34 14.16,80.94 JP30.1
N$26
  Top 0.254: LED5.A 81.71,31.79 81.71,33.96 81.48,34.19 R40.2
RX_CAN
  Top 0.254: LED3.C 83.66,24.13 73.83,33.96 73.83,41.28 U$2.4 73.71,41.28 73.14,41.85 67.2,41.85 U$1.2
SCK  (via drill 0.3)
  Top 0.254: U$1.13 v54.61,46.99
  Bottom 0.254: v54.61,46.99 13.97,46.99 PCB2.D13
TX_CAN
  Top 0.254: LED2.C 85.83,31.79 85.83,32.13 78.28,39.68 77.25,39.68 75.2,41.73 75.2,44.25 74.4,45.05 73.94,45.05 U$2.1 73.83,45.16 72.8,46.19 72.8,46.99 66.4,53.39 66.4,58.88 65.48,59.79 63.65,59.79 62.62,58.76 62.62,44.59 66.51,40.7 67.08,40.7 U$1.1
VCC  (via drill 0.3)
  Top 0.508: 80.8,71.11 80.8,69.85 F1.P$1 80.68,69.62 | 80.8,71.11 82.51,72.82 D24.C | C4.1 63.42,77.16 63.31,77.05 63.31,74.42 U1.1 63.54,74.31 67.77,74.31 68.34,73.74 D26.C | D26.C 68.68,73.74 72.8,73.74 73.25,74.19 C6.1 73.48,74.42 77.03,74.42 C2.1 77.25,74.19 80.23,71.22 80.57,71.22 80.8,71.11 | 87.54,59.68 92.23,59.68 92.69,60.13 JP7.1 | 87.54,59.68 82.74,59.68 D25.C 82.63,59.91 82.32,59.91 D26.C | 87.54,49.51 92,49.51 92.69,50.19 JP6.1 | 87.54,49.51 82.74,49.51 D23.C | 87.54,49.51 87.54,59.68 | R27.1 5.13,25.62 6.39,26.87 10.16,26.87 11.42,25.62 R3.1 11.65,25.73 v12.68,26.76 | R18.1 38.05,25.5 36.79,24.24 30.5,24.24 29.25,25.5 R12.1 29.02,25.39 27.88,24.24 21.82,24.24 20.56,25.5 20.33,25.5 R24.1 | R18.1 38.28,25.39 39.42,24.24 44.22,24.24 45.48,25.5 46.96,25.5 R30.1 47.19,25.39 48.34,24.24 53.14,24.24 54.39,25.5 55.88,25.5 R15.1 56.11,25.39 57.25,24.24 62.05,24.24 63.31,25.5 64.68,25.5 R21.1 64.91,25.73 65.59,26.42 v65.59,26.99 | v39.42,26.87 38.28,25.73 R18.1
  Bottom 0.508: PCB2.VIN 40.56,38.08 40.56,28.02 v39.42,26.87 39.19,26.76 v12.68,26.76 | v65.59,26.99 88.8,50.19 92.69,50.19 JP6.1

### Text on the board
tPlace: D3 GND | D2 GND | D1 GND | V+ GND | Detectino v1.1 | mbrancaleoni@gmail.com | + AUX - | + AUX - | H-CAN-L | T8 GND | T7 GND | T6 GND | T5 GND | T4 GND | T3 GND | T2 GND | T1 GND